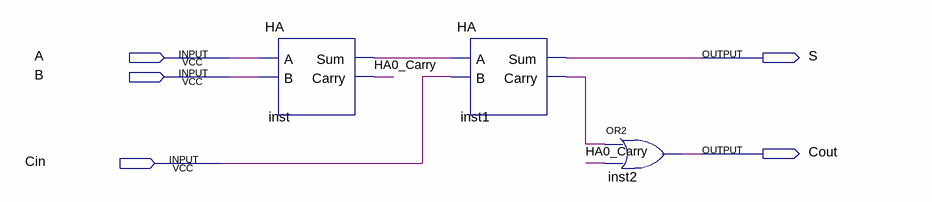
[diagram p0: schematic sheet]
// Quartus schematic FA.bdf as structural Verilog: 3 symbols, 5 pins
module FA (
  input  A,
  input  B,
  input  Cin,
  output S,
  output Cout
);

  wire HA0_Carry, inst1_carry, inst_sum;

  HA inst (.A(A), .B(B), .Sum(inst_sum), .Carry(HA0_Carry));
  HA inst1 (.A(inst_sum), .B(Cin), .Sum(S), .Carry(inst1_carry));
  or inst2 (Cout, inst1_carry, HA0_Carry);
endmodule
